# EAGLE design revA (EAGLE 9.2.2)
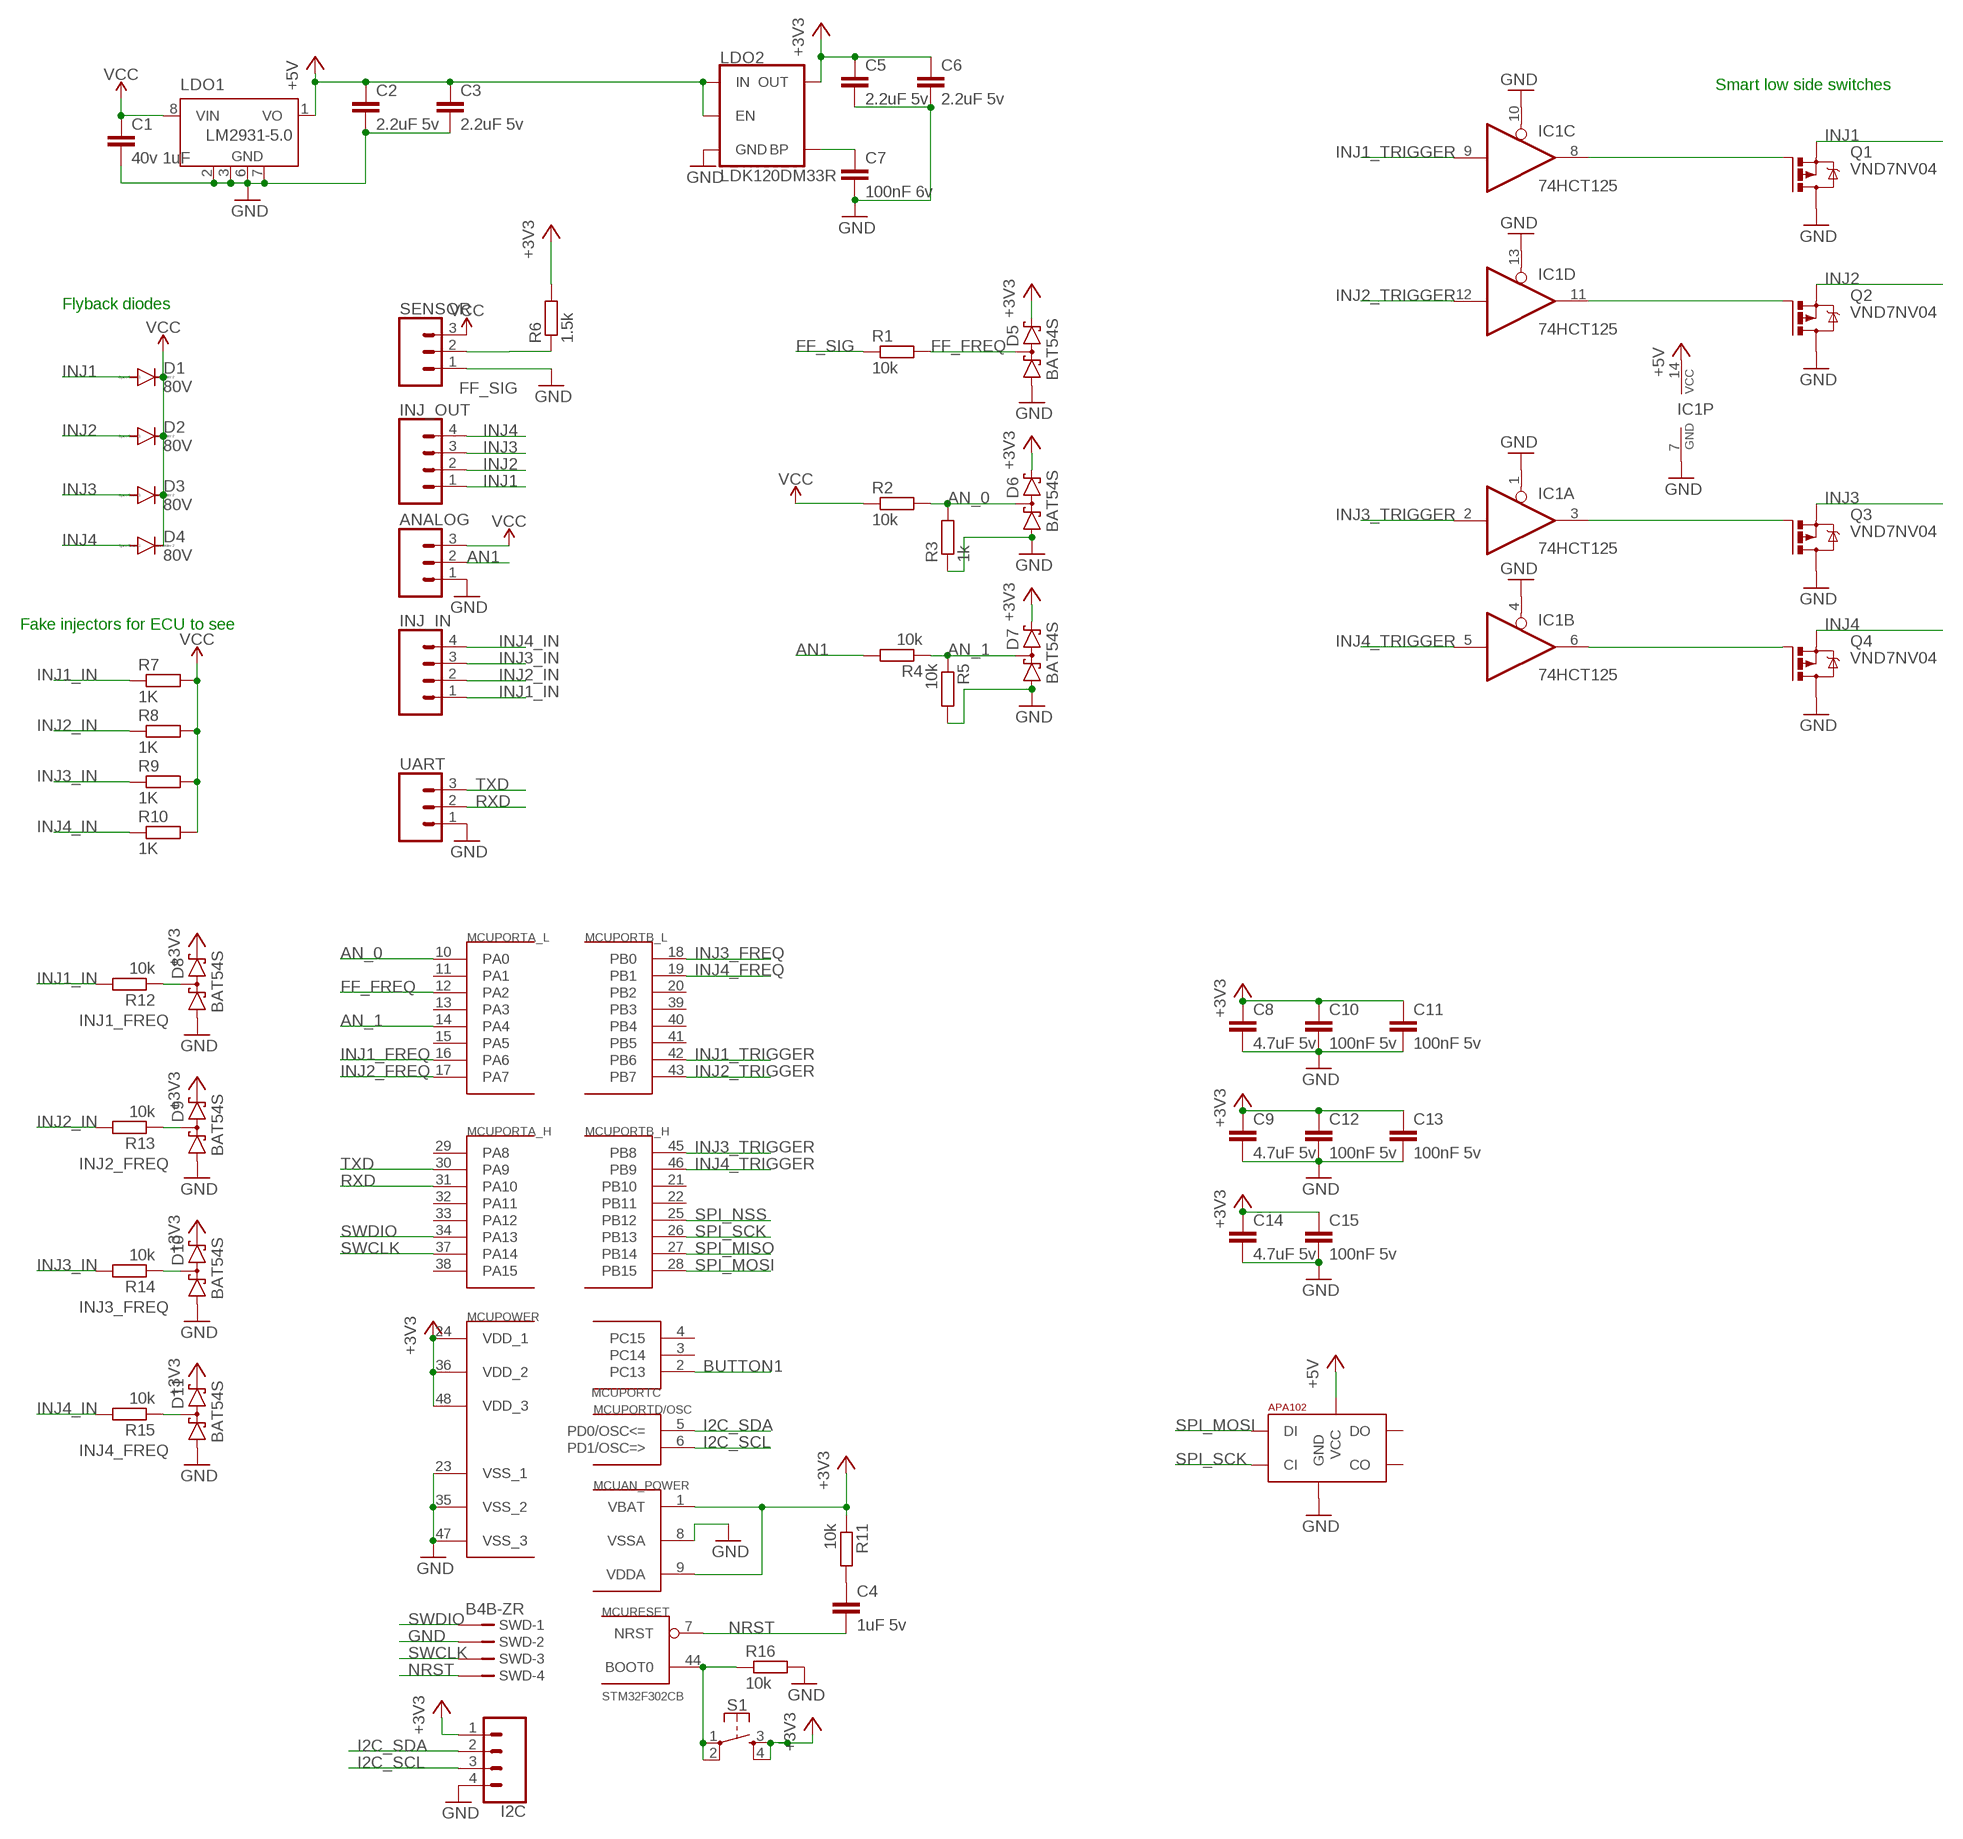
[diagram p0: schematic, sheet 1]

## Parts
ANALOG  CONN_03POLAR_LOCK  [MOLEX-1X3_LOCK]
C1  40v 1uF  C-EUC0603  [C0603]
C2  2.2uF 5v  C-EUC0603  [C0603]
C3  2.2uF 5v  C-EUC0603  [C0603]
C4  1uF 5v  C-EUC0603  [C0603]
C5  2.2uF 5v  C-EUC0603  [C0603]
C6  2.2uF 5v  C-EUC0603  [C0603]
C7  100nF 6v  C-EUC0603  [C0603]
C8  4.7uF 5v  C-EUC0603  [C0603]
C9  4.7uF 5v  C-EUC0603  [C0603]
C10  100nF 5v  C-EUC0603  [C0603]
C11  100nF 5v  C-EUC0603  [C0603]
C12  100nF 5v  C-EUC0603  [C0603]
C13  100nF 5v  C-EUC0603  [C0603]
C14  4.7uF 5v  C-EUC0603  [C0603]
C15  100nF 5v  C-EUC0603  [C0603]
D1  80V  DIODE-SMB  [SMB]
D2  80V  DIODE-SMB  [SMB]
D3  80V  DIODE-SMB  [SMB]
D4  80V  DIODE-SMB  [SMB]
D5  BAT54S  [SOT23]
D6  BAT54S  [SOT23]
D7  BAT54S  [SOT23]
D8  BAT54S  [SOT23]
D9  BAT54S  [SOT23]
D10  BAT54S  [SOT23]
D11  BAT54S  [SOT23]
I2C  CONN_04POLAR_LOCK  [MOLEX-1X4_LOCK]
IC1  74HCT125  74ABT125PW  [TSSOP14]
INJ_IN  CONN_04POLAR_LOCK  [MOLEX-1X4_LOCK]
INJ_OUT  CONN_04POLAR_LOCK  [MOLEX-1X4_LOCK]
LDO1  LM2931-5.0  LM2936M-5.0  [SO08]
LDO2  LDK120DM33R  V_REG_MIC52053.3V  [SOT23-5]
LED  APA1025050  [APA102_5050]
MCU  STM32F302CB  STM32F10XCXT6  [LQFP48_2]
Q1  VND7NV04  IRFR5305  [D-PAK_TO252AA]
Q2  VND7NV04  IRFR5305  [D-PAK_TO252AA]
Q3  VND7NV04  IRFR5305  [D-PAK_TO252AA]
Q4  VND7NV04  IRFR5305  [D-PAK_TO252AA]
R1  10k  R-EU_R0603  [R0603]
R2  10k  R-EU_R0603  [R0603]
R3  1k  R-EU_R0603  [R0603]
R4  10k  R-EU_R0603  [R0603]
R5  10k  R-EU_R0603  [R0603]
R6  1.5k  R-EU_R0603  [R0603]
R7  1K  R-EU_0414/15  [0414/15]
R8  1K  R-EU_0414/15  [0414/15]
R9  1K  R-EU_0414/15  [0414/15]
R10  1K  R-EU_0414/15  [0414/15]
R11  10k  R-EU_R0603  [R0603]
R12  10k  R-EU_R0603  [R0603]
R13  10k  R-EU_R0603  [R0603]
R14  10k  R-EU_R0603  [R0603]
R15  10k  R-EU_R0603  [R0603]
R16  10k  R-EU_R0603  [R0603]
S1  MOMENTARY-SWITCH-SPST-2-SMD-5.2MM  [TACTILE_SWITCH_SMD_5.2MM]
SENSOR  CONN_03POLAR_LOCK  [MOLEX-1X3_LOCK]
SWD  B4B-ZR  [B4B-ZR]
UART  CONN_03POLAR_LOCK  [MOLEX-1X3_LOCK]

## Nets
+3V3 [PWR]: C5.1 C6.1 C8.1 C9.1 C10.1 C11.1 C12.1 C13.1 C14.1 C15.1 D5.2(C2) D6.2(C2) D7.2(C2) D8.2(C2) D9.2(C2) D10.2(C2) D11.2(C2) I2C.1 LDO2.5(OUT) MCU.1(AN_POWER:VBAT) MCU.9(AN_POWER:VDDA) MCU.24(POWER:VDD_1) MCU.36(POWER:VDD_2) MCU.48(POWER:VDD_3) R6.2 R11.1 S1.3 S1.4
+5V [PWR]: C2.1 C3.1 IC1.14(P:VCC) LDO1.1(VO) LDO2.1(IN) LDO2.3(EN) LED.1(VCC)
AN1: ANALOG.2 R4.2
AN_0: D6.3(C1A2) MCU.10(PORTA_L:PA0) R2.2 R3.2
AN_1: D7.3(C1A2) MCU.14(PORTA_L:PA4) R4.1 R5.1
BUTTON: MCU.44(RESET:BOOT0) R16.1 S1.1 S1.2
BUTTON1: MCU.2(PORTC:PC13)
FF_FREQ: D5.3(C1A2) MCU.12(PORTA_L:PA2) R1.2
FF_SIG: R1.1 R6.1 SENSOR.2
GND: ANALOG.1 C1.2 C2.2 C3.2 C5.2 C6.2 C7.2 C8.2 C9.2 C10.2 C11.2 C12.2 C13.2 C14.2 C15.2 D5.1(A1) D6.1(A1) D7.1(A1) D8.1(A1) D9.1(A1) D10.1(A1) D11.1(A1) I2C.4 IC1.1(A:OE) IC1.4(B:OE) IC1.7(P:GND) IC1.10(C:OE) IC1.13(D:OE) LDO1.2(GND) LDO1.3(GND) LDO1.6(GND) LDO1.7(GND) LDO2.2(GND) LED.6(GND) MCU.8(AN_POWER:VSSA) MCU.23(POWER:VSS_1) MCU.35(POWER:VSS_2) MCU.47(POWER:VSS_3) Q1.4(D) Q2.4(D) Q3.4(D) Q4.4(D) R3.1 R5.2 R16.2 SENSOR.1 SWD.2 UART.1
I2C_SCL: I2C.3 MCU.6(PORTD/OSC:PD1/OSC=>)
I2C_SDA: I2C.2 MCU.5(PORTD/OSC:PD0/OSC<=)
INJ1 [INJ]: D1.A INJ_OUT.1 Q1.3(S)
INJ1_FREQ: D8.3(C1A2) MCU.16(PORTA_L:PA6) R12.1
INJ1_IN [INJ]: INJ_IN.1 R7.1 R12.2
INJ1_TRIGGER: IC1.9(C:I) MCU.42(PORTB_L:PB6)
INJ2 [INJ]: D2.A INJ_OUT.2 Q2.3(S)
INJ2_FREQ: D9.3(C1A2) MCU.17(PORTA_L:PA7) R13.1
INJ2_IN [INJ]: INJ_IN.2 R8.1 R13.2
INJ2_TRIGGER: IC1.12(D:I) MCU.43(PORTB_L:PB7)
INJ3 [INJ]: D3.A INJ_OUT.3 Q3.3(S)
INJ3_FREQ: D10.3(C1A2) MCU.18(PORTB_L:PB0) R14.1
INJ3_IN [INJ]: INJ_IN.3 R9.1 R14.2
INJ3_TRIGGER: IC1.2(A:I) MCU.45(PORTB_H:PB8)
INJ4 [INJ]: D4.A INJ_OUT.4 Q4.3(S)
INJ4_FREQ: D11.3(C1A2) MCU.19(PORTB_L:PB1) R15.1
INJ4_IN [INJ]: INJ_IN.4 R10.1 R15.2
INJ4_TRIGGER: IC1.5(B:I) MCU.46(PORTB_H:PB9)
N$1: C4.1 R11.2
N$2: C7.1 LDO2.4(BP)
N$7: IC1.11(D:O) Q2.1(G)
N$8: IC1.8(C:O) Q1.1(G)
N$9: IC1.6(B:O) Q4.1(G)
N$10: IC1.3(A:O) Q3.1(G)
NRST: C4.2 MCU.7(RESET:NRST) SWD.4
RXD: MCU.31(PORTA_H:PA10) UART.2
SPI_MISO: MCU.27(PORTB_H:PB14)
SPI_MOSI: LED.4(DI) MCU.28(PORTB_H:PB15)
SPI_NSS: MCU.25(PORTB_H:PB12)
SPI_SCK: LED.5(CI) MCU.26(PORTB_H:PB13)
SWCLK: MCU.37(PORTA_H:PA14) SWD.3
SWDIO: MCU.34(PORTA_H:PA13) SWD.1
TXD: MCU.30(PORTA_H:PA9) UART.3
VCC [VCC]: ANALOG.3 C1.1 D1.C D2.C D3.C D4.C LDO1.8(VIN) R2.1 R7.2 R8.2 R9.2 R10.2 SENSOR.3
Unconnected: LED.2(CO) LED.3(DO) MCU.3(PORTC:PC14) MCU.4(PORTC:PC15) MCU.11(PORTA_L:PA1) MCU.13(PORTA_L:PA3) MCU.15(PORTA_L:PA5) MCU.20(PORTB_L:PB2) MCU.21(PORTB_H:PB10) MCU.22(PORTB_H:PB11) MCU.29(PORTA_H:PA8) MCU.32(PORTA_H:PA11) MCU.33(PORTA_H:PA12) MCU.38(PORTA_H:PA15) MCU.39(PORTB_L:PB3) MCU.40(PORTB_L:PB4) MCU.41(PORTB_L:PB5)

## Notes on the sheet
- Smart low side switches
- Flyback diodes
- Fake injectors for ECU to see

## Library data of the parts
ANALOG SENSOR UART = SparkFun-Connectors:CONN_03: Multi connection point. Often used as Generic Header-pin footprint for 0.1 inch spaced/style header connections On any of the 0.1 inch spaced packages, you can populate with these: Break Away Headers - Straight <https://www.sparkfun.com/products/116> (PRT-00116) Break Away Male Headers - Right Angle <https://www.sparkfun.com/products/553> (PRT-00553) Female Headers <https://www.sparkfun.com/products/115> (PRT-00115) Break Away Headers - Machine Pin <https://www.sparkfun.com/products/117> (PRT-00117) Break Away Female Headers - Swiss Machine Pin <https://www.sparkfun.com/products/743> (PRT-00743) Stackable Header - 3 Pin (Female, 0.1") <https://www.sparkfun.com/products/13875> (PRT-13875) For SCREWTERMINALS and SPRING TERMINALS visit here: Screw Terimnals on SparkFun.com <https://www.sparkfun.com/search/results?term=Screw+Terminals> (5mm/3.5mm/2.54mm spacing) This device is also useful as a general connection point to wire up your design to another part of your project. Our various solder wires solder well into these plated through hole pads. Hook-Up Wire - Assortment (Stranded, 22 AWG) <https://www.sparkfun.com/products/11375> (PRT-11375) Hook-Up Wire - Assortment (Solid Core, 22 AWG) <https://www.sparkfun.com/products/11367> (PRT-11367) View the entire wire category on our website here <https://www.sparkfun.com/categories/141> Special notes: Molex polarized connector foot print use with SKU : PRT-08232 with associated crimp pins and housings.; PROD_ID: CONN-08625; SF_ID: PRT-08096
C1-C15 = rcl:C-EU: CAPACITOR, European symbol; SPICEPREFIX: C
D1-D4 = diode:DIODE-: DIODE
D5-D11 = diode:BAT54S: Schottky Diodes Pin connection corrected 2011-05-04 Source: Fairchild .. BAT54.pdf
I2C INJ_IN INJ_OUT = SparkFun-Connectors:CONN_04: Multi connection point. Often used as Generic Header-pin footprint for 0.1 inch spaced/style header connections On any of the 0.1 inch spaced packages, you can populate with these: Break Away Headers - Straight <https://www.sparkfun.com/products/116> (PRT-00116) Break Away Male Headers - Right Angle <https://www.sparkfun.com/products/553> (PRT-00553) Female Headers <https://www.sparkfun.com/products/115> (PRT-00115) Break Away Headers - Machine Pin <https://www.sparkfun.com/products/117> (PRT-00117) Break Away Female Headers - Swiss Machine Pin <https://www.sparkfun.com/products/743> (PRT-00743) For SCREWTERMINALS and SPRING TERMINALS visit here: Screw Terimnals on SparkFun.com <https://www.sparkfun.com/search/results?term=Screw+Terminals> (5mm/3.5mm/2.54mm spacing) This device is also useful as a general connection point to wire up your design to another part of your project. Our various solder wires solder well into these plated through hole pads. Hook-Up Wire - Assortment (Stranded, 22 AWG) <https://www.sparkfun.com/products/11375> (PRT-11375) Hook-Up Wire - Assortment (Solid Core, 22 AWG) <https://www.sparkfun.com/products/11367> (PRT-11367) View the entire wire category on our website here <https://www.sparkfun.com/categories/141> Special notes: Molex polarized connector foot print use with SKU : PRT-08231 with associated crimp pins and housings. 1MM SMD Version SKU: PRT-10208; PROD_ID: CONN-08186; SF_ID: PRT-08231
IC1 = misc:74*125: Quad bus BUFFER, 3-state
LDO1 = national-semiconductor:LM2936M?*: Ultra-Low Quiescent Current LDO Voltage Regulator Source: Data sheet <http://www.national.com/ds/LM/LM2936.pdf>; MF: NATIONAL SEMICONDUCTOR; MPN: LM2936M-5.0/NOPB; OC_FARNELL: 9494421; OC_NEWARK: 41K4515
LDO2 = SparkFun-IC-Power:V_REG_MIC5205: V_REG MIC5205 Standard 3.3V, 5V, and Adjustable 150mA LDO voltage regulator in SOT-23 layout. Micrel part MIC5205. BP (by-pass) pin is used to lower output noise with 470pF cap, may be left open. On the adjustable version BP is used to set output.; PROD_ID: VREG-00822; VALUE: 3.3V/150mA
LED = jos-ph:APA102: APA102C 5050 RGB LED -- Adafruit DotStar Single LED Pixel Product Page: https://www.adafruit.com/products/2343 Datasheet: https://cdn-shop.adafruit.com/product-files/2343/APA102C.pdf
MCU = stm32:STM32F10XCXT6: ST STM32F101/103 48pin LQFP
Q1-Q4 = transistor-power:IRF?5305: HEXFET Power MOSFET Source: http://www.irf.com/product-info/datasheets/data/irfr5305pbf.pdf
R1-R16 = rcl:R-EU_: RESISTOR, European symbol; SPICEPREFIX: R
S1 = SparkFun-Switches:MOMENTARY-SWITCH-SPST-2: Momentary Switch (Pushbutton) - SPST - Two Circuits Normally-open (NO) SPST momentary switches (buttons, pushbuttons). Schematic symbol includes two switch circuits. Variants SMD-4.6MMX2.8MM - 4.60mm x 2.80mm Tactile Momentary Button Switch - Used on SparkFun SAMD21 Mini Breakout <https://www.sparkfun.com/products/13664> SMD-5.2MM - Mini Pushbutton Switch - SMD <https://www.sparkfun.com/products/8720> - Used on Arduino Pro Mini <https://www.sparkfun.com/products/11114>; PROD_ID: SWCH-08247; SF_SKU: COM-08720
SWD = con-jst:?4B-ZR: ZH CONNECTOR 1.5 mm, 4 pin 1 row Source: http://www.jst.com .. eZH.pdf; MF: FARNELL; MPN: B4B-ZR(LF)(SN); OC_FARNELL: 1830916; OC_NEWARK: 37K9960

## Net classes
0 default: width 0.2 mm, drill 0.4 mm
1 INJ: width 1 mm, drill 1 mm
2 PWR: width 0.3 mm, drill 0.5 mm
3 VCC: width 0.5 mm, drill 0.6 mm

## Board
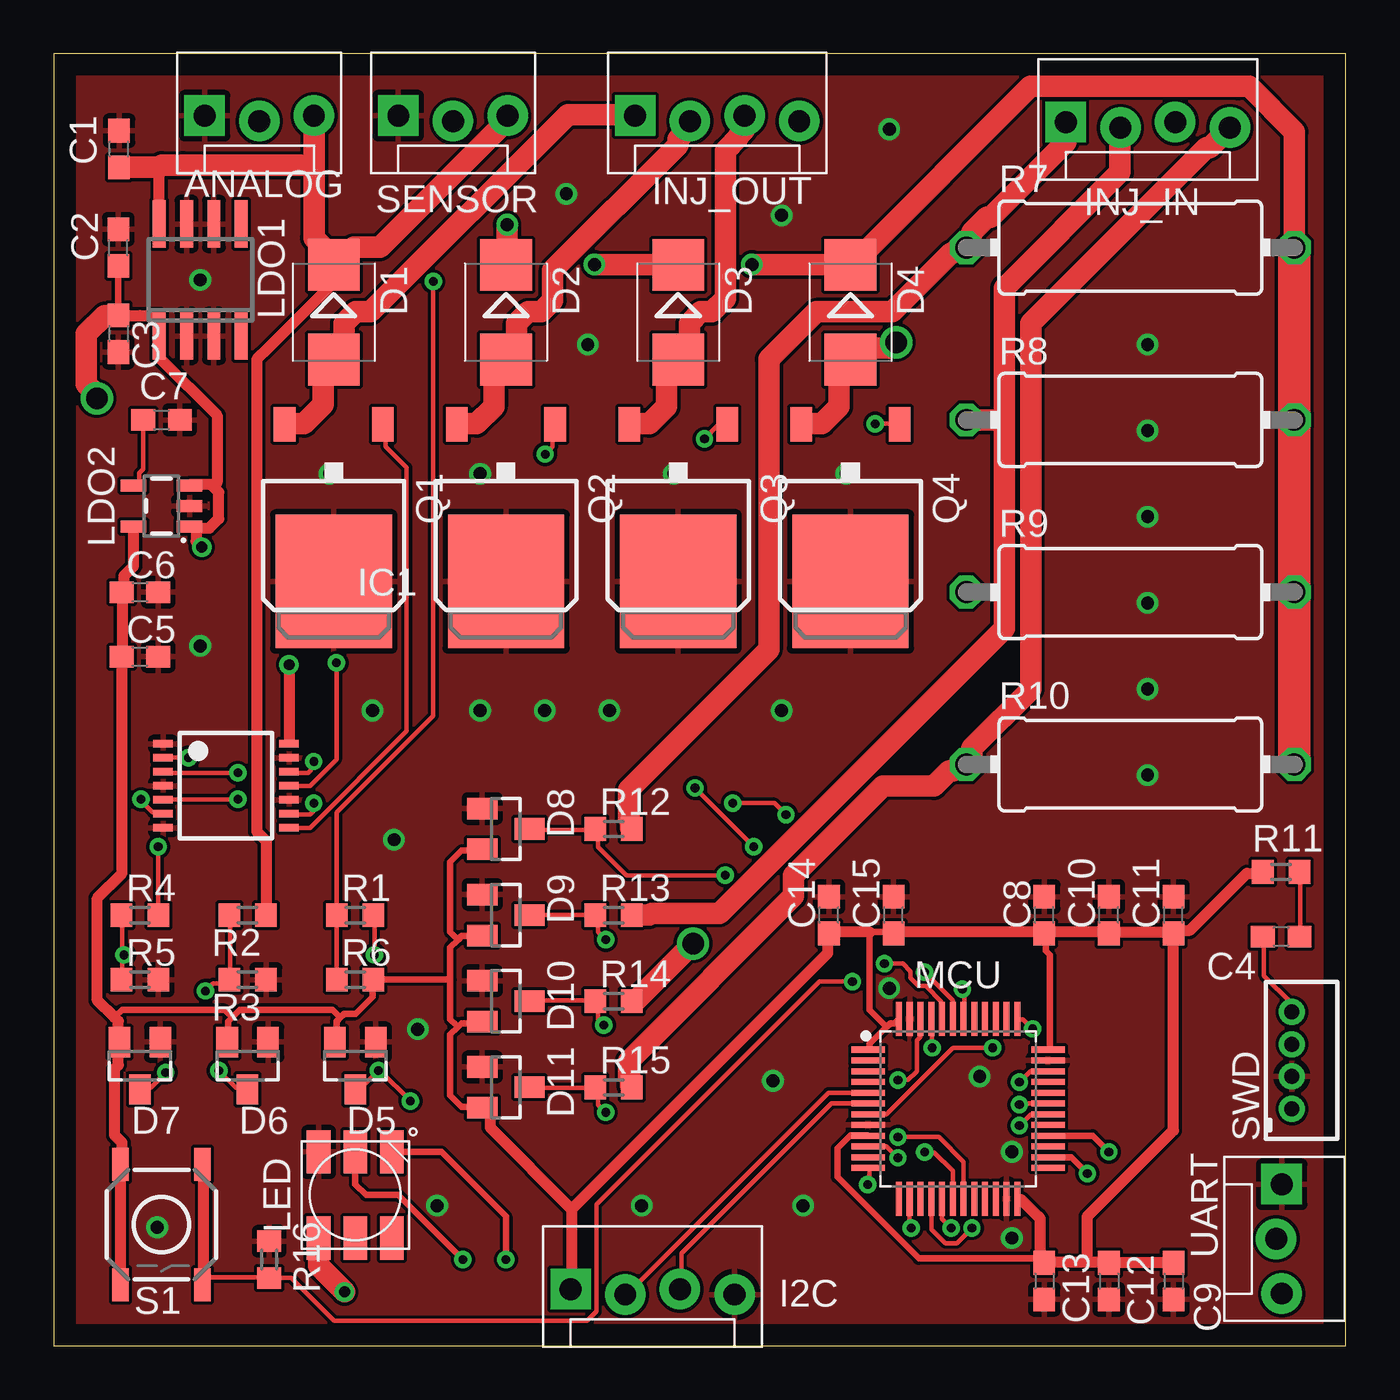
[diagram p1: board, top side]
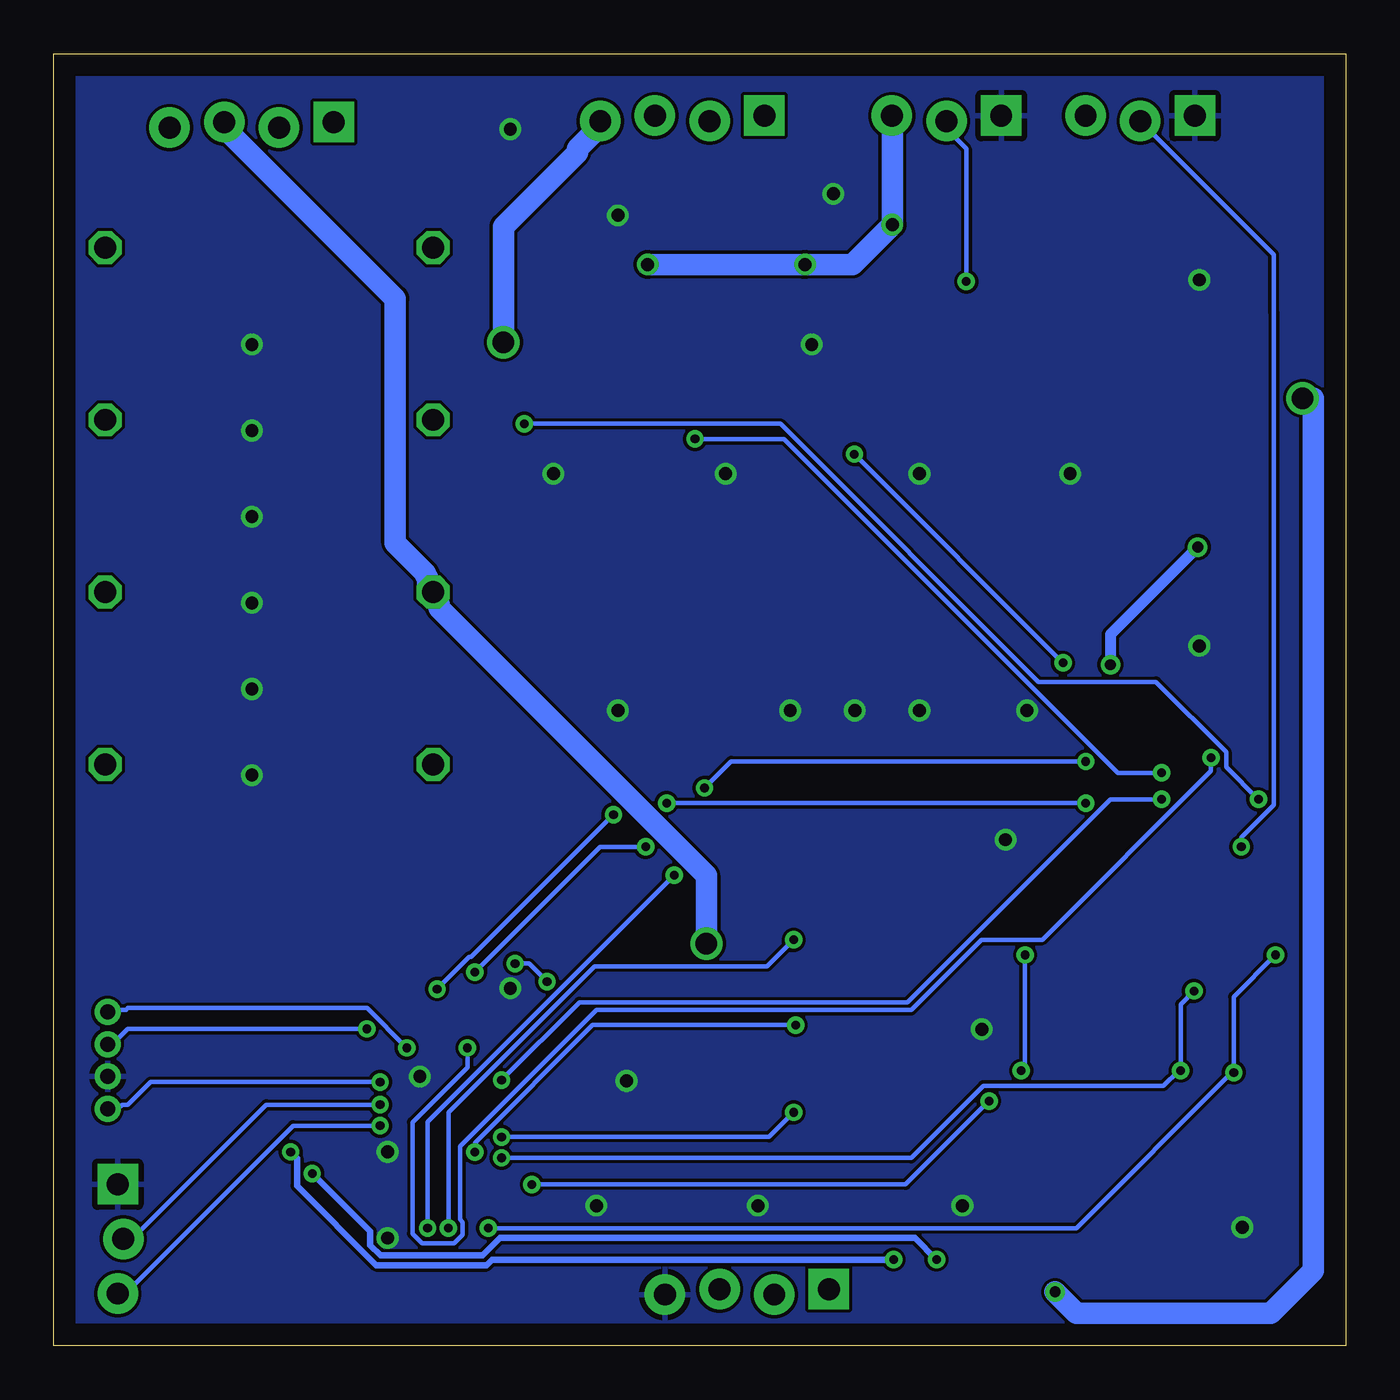
[diagram p2: board, bottom side, seen from below]

Size 60 x 60 mm. Coordinates in mm from the lower left corner, seen from the top.
Outline: 0,0 60,0 60,60 0,60 0,0
Copper layers (1*16): Top 0.035mm / dielectric 1.5mm / Bottom 0.035mm
Design rules "default *": minimum track width 6mil, minimum drill 0.35mm, track to track 6mil, track to pad 6mil, pad to pad 6mil, via to via 6mil, smd to smd 6mil, copper to edge 40mil, drill to drill 6mil, minimum pad ring 10mil, minimum via ring 8mil, stop-mask expansion 4mil, vias tented up to drill 50mil, thermal gap 10mil

### Footprints (pad centres in the part's own frame; a part is rotated, then mirrored left to right if it is on the bottom)
MOLEX-1X3_LOCK = drill 1.016 pad 1.88 square: 1 0,0.127 | drill 1.016 pad 1.88: 2 2.54,-0.127; 3 5.08,0.127
C0603 = smd 1.1 x 1: 1 -0.85,0; 2 0.85,0
SMB = smd 2.4 x 2.4: A 2.2,0; C -2.2,0
SOT23 = smd 1 x 1.4: 1 -0.95,-1.1; 2 0.95,-1.1; 3 0,1.1
MOLEX-1X4_LOCK = drill 1.016 pad 1.88 square: 1 0,0.127 | drill 1.016 pad 1.88: 2 2.54,-0.127; 3 5.08,0.127; 4 7.62,-0.127
TSSOP14 = smd 0.35 x 0.9: 1 -1.95,-2.925; 2 -1.3,-2.925; 3 -0.65,-2.925; 4 0,-2.925; 5 0.65,-2.925; 6 1.3,-2.925; 7 1.95,-2.925; 8 1.95,2.925; 9 1.3,2.925; 10 0.65,2.925; 11 0,2.925; 12 -0.65,2.925; 13 -1.3,2.925; 14 -1.95,2.925
SO08 = smd 0.6 x 2.2: 1 -1.905,-2.6; 2 -0.635,-2.6; 3 0.635,-2.6; 4 1.905,-2.6; 5 1.905,2.6; 6 0.635,2.6; 7 -0.635,2.6; 8 -1.905,2.6
SOT23-5 = smd 0.55 x 1.2: 1 -0.95,-1.3; 2 0,-1.3; 3 0.95,-1.3; 4 0.95,1.3; 5 -0.95,1.3
APA102_5050 = smd 2 x 1.1: 1 2,-1.7; 2 2,0; 3 2,1.7; 4 -2,1.7; 5 -2,0; 6 -2,-1.7
LQFP48_2 = smd 1.559 x 0.28: 1 -4.178,2.75; 2 -4.178,2.25; 3 -4.178,1.75; 4 -4.178,1.25; 5 -4.178,0.75; 6 -4.178,0.25; 7 -4.178,-0.25; 8 -4.178,-0.75; 9 -4.178,-1.25; 10 -4.178,-1.75; 11 -4.178,-2.25; 12 -4.178,-2.75; 25 4.178,-2.75; 26 4.178,-2.25; 27 4.178,-1.75; 28 4.178,-1.25; 29 4.178,-0.75; 30 4.178,-0.25; 31 4.178,0.25; 32 4.178,0.75; 33 4.178,1.25; 34 4.178,1.75; 35 4.178,2.25; 36 4.178,2.75 | smd 0.28 x 1.559: 13 -2.75,-4.178; 14 -2.25,-4.178; 15 -1.75,-4.178; 16 -1.25,-4.178; 17 -0.75,-4.178; 18 -0.25,-4.178; 19 0.25,-4.178; 20 0.75,-4.178; 21 1.25,-4.178; 22 1.75,-4.178; 23 2.25,-4.178; 24 2.75,-4.178; 37 2.75,4.178; 38 2.25,4.178; 39 1.75,4.178; 40 1.25,4.178; 41 0.75,4.178; 42 0.25,4.178; 43 -0.25,4.178; 44 -0.75,4.178; 45 -1.25,4.178; 46 -1.75,4.178; 47 -2.25,4.178; 48 -2.75,4.178
D-PAK_TO252AA = smd 1 x 1.6: 1 -2.28,-4.8; 3 2.28,-4.8 | smd 5.4 x 6.2: 4 0,2.5
R0603 = smd 1 x 1.1: 1 -0.85,0; 2 0.85,0
0414/15 = drill 1.016 octagon: 1 -7.62,0; 2 7.62,0
TACTILE_SWITCH_SMD_5.2MM = smd 1.524 x 0.762: 1 -2.794,1.905; 2 2.794,1.905; 3 -2.794,-1.905; 4 2.794,-1.905
B4B-ZR = drill 0.7 pad 1.1: 1 -2.25,0; 2 -0.75,0; 3 0.75,0; 4 2.25,0

### Placement (x,y rotation side)
ANALOG  7,57 0 top
C1  3.03,55.58 90 top
C2  3,51 90 top
C3  3,47 270 top
C4  57,19 180 top
C5  4,32 0 top
C6  4,35 0 top
C7  5,43 0 top
C8  46,20 90 top
C9  52,3 270 top
C10  49,20 90 top
C11  52,20 90 top
C12  49,3 270 top
C13  46,3 270 top
C14  36,20 90 top
C15  39,20 90 top
D1  13,48 270 top
D2  21,48 270 top
D3  29,48 270 top
D4  37,48 270 top
D5  14,13 180 top
D6  9,13 180 top
D7  4,13 180 top
D8  21,24 270 top
D9  21,20 270 top
D10  21,16 270 top
D11  21,12 270 top
I2C  24,2.5 0 top
IC1  8,26 270 top
INJ_IN  47,56.7 0 top
INJ_OUT  27,57 0 top
LDO1  6.8,49.5 0 top
LDO2  5,39 90 top
LED  14,7 270 top
MCU  42,11 0 top
Q1  13,38 180 top
Q2  21,38 180 top
Q3  29,38 180 top
Q4  37,38 180 top
R1  14,20 0 top
R2  9,20 180 top
R3  9,17 180 top
R4  4,20 0 top
R5  4,17 0 top
R6  14,17 0 top
R7  50,51 0 top
R8  50,43 0 top
R9  50,35 0 top
R10  50,27 0 top
R11  57,22 0 top
R12  26,24 0 top
R13  26,20 0 top
R14  26,16 0 top
R15  26,12 0 top
R16  10,4 90 top
S1  5,5.62 270 top
SENSOR  16,57 0 top
SWD  57.5,13.25 90 top
UART  56.9,7.5 270 top

### Tracks (layer width: path | path; a pad name or v marks a point on that pad's centre or on a via)
+3V3
  Top 0.3: 46.08,3.88 C13.1 | 48.98,3.88 C12.1 49.16,3.88 | 51.98,3.88 C9.1 | MCU.9 37.8,9.78 37,9.78 36.38,9.16 36.38,7.84 40.17,4.05 45.81,4.05 45.9,3.96 C13.1 | 44.93,6.78 44.76,6.78 MCU.24 | 45.81,5.9 45.72,5.99 45.81,6.08 | 45.81,4.14 C13.1 | 36.03,19.21 C14.1 35.95,19.03 | 38.68,14.8 38.85,14.98 39.09,14.98 39.09,15.02 MCU.48 | 38.68,14.8 37.88,14.01 37.88,13.83 MCU.1 | 38.68,14.8 38.59,14.89 37.88,15.59 37.88,19.12 37.88,19.21 38.94,19.21 C15.1 39.12,19.21 | 46.08,19.21 C8.1 | 48.98,19.21 C10.1 49.07,19.21 | 51.98,19.21 C11.1 52.07,19.29 | 56.12,21.94 R11.1 | MCU.36 46.25,13.83 46.25,14.54 46.25,18.15 46.08,18.32 46.08,19.03 C8.1 | 45.9,19.21 C8.1 | 3.17,32.07 C5.1 3.17,31.89 | 3.17,34.98 C6.1 3.26,35.06 | 3.7,37.97 LDO2.5 | 3,14.1 D7.2 3,14.18 | 3.17,8.46 S1.3 3.08,8.28 | 3.08,2.91 S1.4 | 13.3,15.24 13.13,15.06 13.13,14.18 D5.2 | 13.3,15.24 13.48,15.42 14.01,15.42 14.8,16.21 14.8,16.91 R6.2 14.98,17 18.32,17 18.41,17 | 8.28,15.24 8.63,15.59 12.95,15.59 13.21,15.33 13.3,15.24 | 8.28,15.24 8.11,15.06 8.11,14.18 D6.2 | 18.77,14.8 18.94,14.98 19.82,14.98 D10.2 | 18.77,14.8 18.41,14.45 18.41,11.63 18.94,11.1 19.82,11.1 D11.2 20,11.01 20.26,10.75 | 18.77,18.85 18.41,18.5 18.41,17 | 18.77,18.85 18.94,19.03 19.82,19.03 D9.2 | 18.41,17 18.41,15.15 18.68,14.89 18.77,14.8 | D8.2 19.82,22.99 18.94,22.99 18.41,22.46 18.41,19.21 18.68,18.94 18.77,18.85 | 24.05,2.64 I2C.1 | 2.82,15.24 2.91,15.33 3.17,15.59 7.93,15.59 8.19,15.33 8.28,15.24 | 24.14,6.43 24.05,6.34
  Top 0.5: 48.98,3.88 48,3.88 | 48,3.88 46.08,3.88 | 49.16,3.88 51.98,3.88 | 45.72,5.99 44.93,6.78 | 45.81,4.14 45.81,5.9 | 37.88,19.21 36.03,19.21 | 48.98,19.21 46.08,19.21 | 49.07,19.21 51.98,19.21 52,19.18 52,10 48,6 48,3.88 | 56.12,21.94 55.41,21.94 52.77,19.29 52.07,19.29 | 45.9,19.21 39.12,19.21 | 3.17,34.98 3.17,32.07 | 3.7,37.97 3.7,36.21 3.26,35.77 3.26,35.06 | 3,14.1 3,13.04 2.82,12.86 2.82,9.78 3.17,9.43 3.17,8.46 | 3.08,8.28 3.08,2.91 | 3.17,31.89 3.17,21.94 2.03,20.79 2.03,16.03 2.82,15.24 3,15.06 3,14.18 | 24.05,2.64 24.05,6.34 20.26,10.13 20.26,10.75 | 35.95,19.03 35.95,18.24 24.14,6.43
+5V  (via drill 0.5, 1)
  Top 0.3: 3.17,47.75 3.08,47.84 C3.1 3,47.93 3,50.13 C2.1 | 6.61,37.88 6.52,37.97 6.34,37.97 LDO2.1 6.61,38.06 6.7,38.06 6.78,37.97 | 10.92,28.02 IC1.14 | 7.31,40 7.4,39.91 7.49,40 7.58,40.09 | 6.34,40 LDO2.3 | 4,47.85 4.15,47.85 | 4.89,45.9 LDO1.1 4.89,47.7 5,47.8 4.95,47.85
  Top 0.5: v10.92,31.63 10.92,28.02 | v6.87,37.09 6.61,37.35 6.61,37.88 | 7.31,40 6.34,40 | 7.4,39.91 7.67,39.65 7.67,38.41 7.22,37.97 6.78,37.97 | C3.1 4,47.85 4.95,47.85 | 7.58,40.09 7.58,43.22 4.89,45.9
  Top 1: v2,44 2,44.18 1.52,44.66 1.52,47 2.37,47.85 C3.1 | LED.1 12.3,3.7 v13.5,2.5
  Bottom 0.5: v10.92,31.63 10.92,33.04 v6.87,37.09
  Bottom 1: v2,44 1.52,44 1.52,3.48 3.48,1.52 12.52,1.52 v13.5,2.5
AN1  (via drill 0.4)
  Top 0.2: v4.85,23.17 4.85,20.09 R4.2
  Bottom 0.2: v4.85,23.17 4.85,23.61 3.35,25.11 3.35,48 | 3.35,48.01 3.35,48 | 3.35,48 3.35,50.68 ANALOG.2
AN_0  (via drill 0.4)
  Top 0.2: R2.2 8.19,20 8.19,17 R3.2 8.11,16.91 8.02,16.83 7.4,16.83 v7.05,16.48 | v7.67,12.77 8.46,11.98 8.99,11.98 D6.3 | 37.88,9.25 MCU.10 38.68,9.25 v39.2,8.72
  Bottom 0.2: v7.05,16.48 7.67,15.86 v7.67,12.77 7.75,12.77 8.46,12.07 16.83,12.07 20.18,8.72 v39.2,8.72
AN_1  (via drill 0.4)
  Top 0.2: 3.17,18.15 3.17,20 R4.1 | 3.17,18.15 3.17,17 R5.1 | v5.2,12.69 4.49,11.98 4.05,11.98 D7.3 | v3.26,18.15 3.17,18.15 | v39.82,5.46 39.73,5.55 39.73,6.78 MCU.14
  Bottom 0.2: v3.26,18.15 5.2,16.21 v5.2,12.69 5.29,12.69 12.51,5.46 v39.82,5.46
BUTTON  (via drill 0.4)
  Top 0.2: 6.96,3.52 7.22,3.26 S1.2 6.96,2.91 7.22,3.17 9.92,3.17 R16.1 11.02,3.15 13.03,1.15 24.76,1.15 25.2,1.59 25.2,6.56 35.55,16.91 v37.09,16.91 | 6.96,8.37 S1.1 | v38.58,17.75 39,17.75 39.43,17.75 39.78,17.39 39.78,17.08 40.17,16.7 40.51,16.7 41.23,15.97 41.23,15.24 MCU.44
  Top 0.5: 6.96,3.52 6.96,8.37
  Bottom 0.2: v38.58,17.75 37.93,17.75 v37.09,16.91
FF_FREQ  (via drill 0.4)
  Top 0.2: v14.89,18.15 14.89,20 R1.2 | D5.3 14.01,11.98 14.27,11.98 v15.06,12.77 15.15,12.77 v16.56,11.37 | v37.8,7.49 37.88,7.58 37.88,8.19 MCU.12
  Bottom 0.2: v14.89,18.15 14.89,12.95 v15.06,12.77 | v37.8,7.49 20.44,7.49 v16.56,11.37
FF_SIG  (via drill 0.4)
  Top 0.2: R6.1 13.13,17 13.13,20 R1.1 13.13,20.09 13.13,24.76 17.62,29.25 v17.62,49.42
  Bottom 0.2: v17.62,49.42 17.62,55.59 18.5,56.47 18.5,56.83 SENSOR.2
GND  (via drill 0.6)
  other vias: 44.5,5 44.5,9 34.8,6.5 38.8,16.6 17.8,6.5 22.8,29.5 15.8,23.5 6.8,32.5 6.8,49.5 27.3,6.5 33.4,12.3 50.8,46.5 50.8,42.5 50.8,38.5 50.8,34.5 50.8,30.5 50.8,26.5 24.8,46.5 33.8,52.5 23.8,53.5 25.8,29.5 19.8,29.5 33.8,29.5 14.8,29.5 12.8,40.5 19.8,40.5 28.8,40.5 36.8,40.5 4.8,5.5 38.8,56.5 16.9,14.7 43,12.5
  pour Top: 0,60 60,60 60,0 0,0
  pour Bottom: 0,60 60,60 60,0 0,0
I2C_SCL
  Top 0.2: 37.8,11.28 MCU.6 36.11,11.25 29.16,4.3 29.16,2.64 I2C.3
I2C_SDA
  Top 0.2: 37.8,11.72 MCU.5 35.98,11.75 26.57,2.34 I2C.2
INJ1
  Top 1: Q1.3 10.75,42.82 11.63,42.82 12.51,43.7 12.51,45.28 12.95,45.72 D1.A 13.21,46.25 13.48,46.52 13.48,47.49 14.01,48.01 14.71,48.01 23.88,57.18 26.96,57.18 INJ_OUT.1
INJ1_FREQ  (via drill 0.4)
  Top 0.2: D8.3 22.11,23.96 25.11,23.96 R12.1 25.11,23.88 25.29,23.7 25.29,23.17 26.61,21.85 v31.19,21.85 | v42.64,5.46 41.94,4.76 41.41,4.76 40.75,5.41 MCU.16
  Bottom 0.2: v42.64,5.46 42.64,10.4 v31.19,21.85
INJ1_IN
  Top 1: R12.2 26.78,24.05 26.78,24.4 26.69,24.49 26.69,25.81 33.21,32.33 33.21,45.81 35.42,48.01 38.94,48.01 41.67,50.75 41.76,50.75 42.11,51.1 42.29,51.1 R7.1 42.55,51.54 42.64,51.63 42.64,51.72 43.34,52.42 43.52,52.42 47,55.9 INJ_IN.1
INJ1_TRIGGER  (via drill 0.4)
  Top 0.2: v12.07,25.2 12.07,24.84 11.89,24.67 11.45,24.67 11.01,24.67 IC1.9 | v31.54,25.2 33.48,25.2 v34.01,24.67 | v42.2,16.56 42.2,16.53 42.29,16.45 42.29,15.24 MCU.42
  Bottom 0.2: v31.54,25.2 v12.07,25.2 | v34.01,24.67 40.61,18.06 40.7,18.06 v42.2,16.56
INJ2
  Top 1: Q2.3 18.77,42.82 19.65,42.82 20.44,43.61 20.44,45.2 20.97,45.72 D2.A 21.32,46.16 21.5,46.34 21.5,47.49 22.02,48.01 22.64,48.01 23.17,48.54 23.17,49.95 28.98,55.77 28.98,56.03 29.51,56.56 29.51,56.83 INJ_OUT.2
INJ2_FREQ  (via drill 0.4)
  Top 0.2: D9.3 22.11,20 25.11,20 R13.1 25.2,19.91 25.29,19.82 25.29,19.21 v25.64,18.85 | 41.23,6.78 MCU.17 41.25,5.88 v41.67,5.46
  Bottom 0.2: v41.67,5.46 41.67,10.84 34.89,17.62 26.87,17.62 v25.64,18.85
INJ2_IN
  Top 1: R13.2 26.87,20 27.66,20 27.75,20.09 30.92,20.09 44.14,33.3 44.14,43 | 44.14,43 44.14,49.12 49.51,54.5 49.51,56.55 INJ_IN.2 | R8.1 44.14,43
INJ2_TRIGGER  (via drill 0.4)
  Top 0.2: v12.07,27.14 12.07,26.87 11.8,26.61 11.01,26.61 IC1.12 | v32.51,23.17 v29.78,25.9 | v40.44,17.36 41.75,16.05 MCU.43
  Bottom 0.2: v12.07,27.14 28.54,27.14 v29.78,25.9 | v32.51,23.17 34.62,23.17 v40.44,17.36
INJ3
  Top 1: Q3.3 26.78,42.82 27.66,42.82 28.46,43.61 28.46,45.2 28.98,45.72 D3.A 29.25,46.25 29.51,46.52 29.51,47.49 30.04,48.01 30.57,48.01 31.19,48.63 31.19,55.5 31.8,56.12 31.8,56.21 32.07,56.47 32.07,57.09 INJ_OUT.3
INJ3_FREQ  (via drill 0.4)
  Top 0.2: D10.3 22.11,16.03 25.11,16.03 R14.1 25.2,15.95 25.29,15.86 25.29,15.15 v25.55,14.89 | v40.44,8.99 40.88,8.99 41.75,8.12 MCU.18 41.76,6.87
  Bottom 0.2: v40.44,8.99 40.44,9.43 34.98,14.89 v25.55,14.89
INJ3_IN  (via drill 1)
  Top 1: v29.69,18.68 27.05,16.03 26.87,16.03 R14.2
  Bottom 1: v29.69,18.68 29.69,21.85 42.11,34.27 42.11,34.45 42.38,34.71 42.38,34.98 R9.1 42.64,35.42 42.64,35.68 42.73,35.77 42.73,35.86 44.14,37.27 44.14,48.63 52.08,56.57 INJ_IN.3
INJ3_TRIGGER  (via drill 0.4)
  Top 0.2: v6.25,27.31 6.08,27.31 5.11,27.31 IC1.2 | MCU.45 40.79,15.14 v40.79,13.83
  Bottom 0.2: v6.25,27.31 6.25,26.69 14.1,18.85 16.91,18.85 20.18,15.59 34.8,15.59 41.14,9.25 41.14,6 | v40.79,13.83 40.79,12.93 43.34,10.38 43.34,5.2 42.91,4.76 42,4.76 41.41,4.76 41.02,5.15 41.02,5.73 41.14,5.86 41.14,6 | 41.14,6 41.14,5.94
INJ4  (via drill 1)
  Top 1: Q4.3 34.8,42.82 35.68,42.82 36.47,43.61 36.47,45.28 36.91,45.72 D4.A 37.27,46.25 37.35,46.34 38.85,46.34 v39.12,46.6
  Bottom 1: v39.12,46.6 39.12,51.98 35.68,55.41 35.68,55.59 34.62,56.65 34.62,56.83 INJ_OUT.4
INJ4_FREQ  (via drill 0.4)
  Top 0.2: D11.3 22.11,11.98 25.11,11.98 R15.1 25.11,11.89 25.29,11.72 25.29,11.19 v25.64,10.84 | 42.29,6.87 MCU.19 42.25,8.55 41.11,9.69 v39.2,9.69
  Bottom 0.2: v39.2,9.69 26.78,9.69 v25.64,10.84
INJ4_IN
  Top 1: R15.2 26.78,12.07 26.78,12.42 26.69,12.51 26.69,13.21 34.36,20.88 34.36,21.85 38.5,25.99 40.88,25.99 41.58,26.69 41.76,26.69 42.11,27.05 42.38,27.05 R10.1 42.64,27.49 42.64,27.75 45.37,30.48 45.37,47.49 53.53,55.65 53.7,55.65 INJ_IN.4
INJ4_TRIGGER  (via drill 0.4)
  Top 0.2: v8.55,25.37 5.48,25.37 5.39,25.29 5.11,25.29 IC1.5 | v39.2,12.33 39.68,12.33 40.09,12.74 40.09,14.18 40.25,14.35 MCU.46 40.26,15.15
  Bottom 0.2: v8.55,25.37 10.92,25.37 20.35,15.95 35.59,15.95 v39.2,12.33
N$1
  Top 0.2: C4.1 57.88,19.03 57.88,21.94 R11.2
N$2
  Top 0.2: C7.1 4.14,40.7 3.96,40.53 3.96,40.17 3.7,39.91 LDO2.4
N$7  (via drill 0.4)
  Top 0.2: v13.13,31.72 13.13,27.22 11.89,25.99 11.01,25.99 IC1.11 | v22.82,41.41 23.17,41.76 23.17,42.64 23.26,42.73 Q2.1
  Bottom 0.2: v22.82,41.41 v13.13,31.72
N$8
  Top 0.2: IC1.8 11.01,24.05 11.89,24.05 16.39,28.54 16.39,40.79 15.42,41.76 15.42,42.64 15.33,42.73 Q1.1
N$9  (via drill 0.4)
  Top 0.2: v4.05,25.37 4.14,25.29 4.14,25.2 4.58,24.76 5.02,24.76 IC1.6 | v38.15,42.82 39.2,42.82 Q4.1
  Bottom 0.2: v4.05,25.37 5.55,26.87 5.55,27.57 8.81,30.84 14.27,30.84 26.25,42.82 v38.15,42.82
N$10  (via drill 0.4)
  Top 0.2: v8.55,26.61 5.39,26.61 5.3,26.69 5.11,26.69 IC1.3 | v30.22,42.11 30.84,42.73 31.28,42.73 Q3.1
  Bottom 0.2: v8.55,26.61 10.57,26.61 26.08,42.11 v30.22,42.11
NRST  (via drill 0.4)
  Top 0.2: C4.2 56.21,18.94 56.21,17.18 57.44,15.95 57.44,15.51 SWD.4 | v43.61,13.83 41.76,13.83 38.68,10.75 37.88,10.75 MCU.7
  Bottom 0.2: v43.61,13.83 45.46,15.68 56.56,15.68 56.65,15.59 57.35,15.59 57.44,15.51 SWD.4
RXD  (via drill 0.4)
  Top 0.2: 46.16,11.28 MCU.31 44.9,11.25 v44.84,11.19
  Bottom 0.2: v44.84,11.19 50.13,11.19 56.3,5.02 56.74,5.02 UART.2
SPI_MOSI  (via drill 0.4)
  Top 0.3: MCU.28 48.25,9.75 v49,9 | LED.4 18,9 21,6 v21,4
  Bottom 0.3: v21,4 39.65,4 39.9,3.74 45.02,3.74 48.71,7.43 48.71,8.71 v49,9
SPI_SCK  (via drill 0.4)
  Top 0.3: MCU.26 47.25,8.75 v48,8 | LED.5 14,7.5 14.5,7 16,7 v19,4
  Bottom 0.3: v48,8 45.31,5.31 45.31,4.67 44.83,4.19 40.09,4.19 39.29,5 20,5 v19,4
SWCLK  (via drill 0.4)
  Top 0.2: v45.46,14.71 45.02,15.15 44.76,15.15 MCU.37
  Bottom 0.2: v45.46,14.71 56.56,14.71 57.27,14.01 57.44,14.01 SWD.3
SWDIO  (via drill 0.4)
  Top 0.2: v44.84,12.25 45.37,12.77 46.16,12.77 MCU.34
  Bottom 0.2: v44.84,12.25 55.5,12.25 56.56,11.19 56.83,11.19 57,11.01 57.44,11.01 SWD.1
TXD  (via drill 0.4)
  Top 0.2: 46.16,10.75 MCU.30 45.37,10.75 v44.84,10.22
  Bottom 0.2: v44.84,10.22 48.9,10.22 56.65,2.47 57,2.47 UART.3
VCC  (via drill 0.6)
  Top 0.5: 21.06,50.22 D2.C | 28.98,50.22 D3.C | 36.91,50.22 D4.C 37.18,50.3 37.84,50.3 | 3.1,54.7 C1.1 | R2.1 9.87,20.09 9.87,23.43 9.43,23.88 9.43,45.81 9.96,46.34 12.95,49.34 12.95,50.13 D1.C 13.21,50.3 13.92,51.01 | 21.06,57.09 SENSOR.3 | 6.03,54.8 6,54.83 | LDO1.8 4.89,54.73 4.89,54.83 5,54.83
  Top 1: v21.06,52.07 21.06,50.22 | v25.11,50.22 28.98,50.22 | v32.42,50.22 36.91,50.22 | 21.06,57.09 21.06,56.91 15.15,51.01 13.92,51.01 | R7.2 57.62,56.38 55.52,58.48 | 55.52,58.48 55,58.48 | 55.52,58.48 45.36,58.48 37.18,50.3 | ANALOG.3 12.08,55 | 12.08,55 12.08,51.44 13.21,50.3 | C1.1 4.89,54.73 | 5,54.83 6,54.83 11.91,54.83 12.08,55
  Top 1.5: R10.2 R9.2 R8.2 R7.2
  Bottom 0.5: 21.14,57.09 SENSOR.3
  Bottom 1: v32.42,50.22 25.29,50.22 v25.11,50.22 22.91,50.22 21.23,51.89 v21.06,52.07 21.06,57.1 SENSOR.3